# Altium schematic sheet Connectors.SchDoc
size A4; SheetNumber: 1; SheetTotal: 5
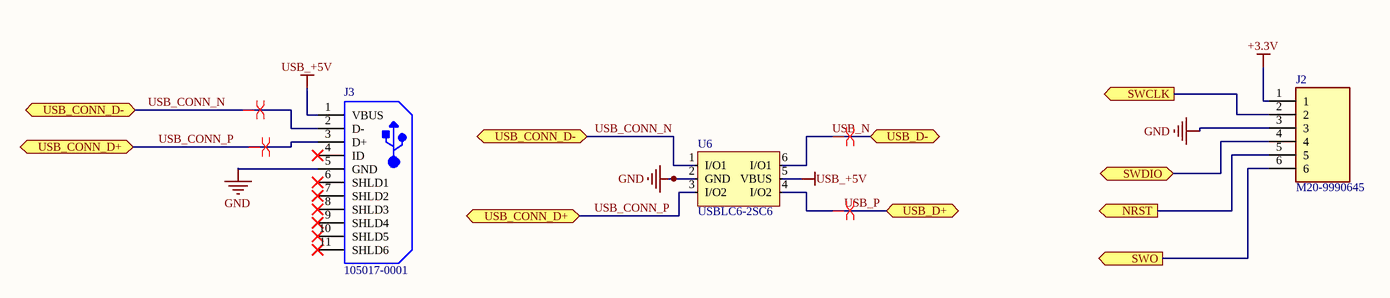
[diagram p0: Connectors.SchDoc]

## Parts
J2  M20-9990645  [M20-9990645-Footprint-1]
J3  105017-0001  [USB-MICRO-B_V]
U6  USBLC6-2SC6  [STM-SOT23-6L_V]

## Ports
NRST (out, see MCU[2A], MCU[2B]), SWCLK (out, see MCU[2C]), SWDIO (bidir, see MCU[2C]), SWO (out, see MCU[3B]), USB_CONN_D+ (bidir, see Connectors[1B]), USB_CONN_D+ (bidir, see Connectors[2C]), USB_CONN_D- (bidir, see Connectors[1B]), USB_CONN_D- (bidir, see Connectors[2B]), USB_D+ (bidir, see MCU[2C]), USB_D- (bidir, see MCU[2C])

## Nets
+3.3V: J2.1
GND: J2.3 J3.5(GND) U6.2(GND)
USB_+5V: J3.1(VBUS) U6.5(VBUS)
NRST: J2.5 ; port NRST
SWCLK: J2.2 ; port SWCLK
SWDIO: J2.4 ; port SWDIO
SWO: J2.6 ; port SWO
USB_CONN_N: J3.2(D-) U6.1(I/O1) ; port USB_CONN_D-
USB_CONN_P: J3.3(D+) U6.3(I/O2) ; port USB_CONN_D+
USB_N: U6.6(I/O1) ; port USB_D-
USB_P: U6.4(I/O2) ; port USB_D+

Not connected (* = marked no-connect by the designer): J3 4(ID)* 6(SHLD1)* 7(SHLD2)* 8(SHLD3)* 9(SHLD4)* 10(SHLD5)* 11(SHLD6)*

## Layout directives
differential pair: USB_CONN_N, USB_CONN_P, USB_N, USB_P

## Library data of the parts
J2 = CMP-002-00072-1: Board Connector, 6 Contact(s), 1 Row(s), Male, Straight, 0.1 inch Pitch, Solder Terminal, Locking, Black Insulator; Min Operating Temperature: -40°C; Max Operating Temperature: 105°C; Mounting Technology: Board; RoHS Compliant: Yes; Connector Type: BOARD CONNECTOR
J3 = CMP-2000-05827-1: Micro-USB B Receptacle, Right Angle, Bottom Mount, Surface Mount, with Solder Tabs, -30 to 85 degC, 5-Pin USB, RoHS, Tape and Reel; Manufacturer: Molex; Featured Product: Micro-USBConnectorsUSBConnectors; Other Names: WM1399DKR; Package Version: Rev. F, 12/2012; Number of Contacts: 5; Connector Type: USB-microB; Catalog Drawings: 1050170001; 3D Model: 105017-0001.stp; Mating Products: WM17145-ND-CABLEMICROUSBBTOSTDA1.0MWM17147-ND-CABLEMICROUSBBTOSTDA2.0MWM17146-ND-CABLEMICROUSBBTOSTDA1.5M; PCN Assembly/Origin: ResinSupplier21/Oct/2015; Voltage - Max: 30V; Online Catalog: Molex-MicroUSB; Manufacturer URL: http://www.molex.com/; Package Description: 5-Leads USB, Micro B, Body 7.5 x 5 mm, Pitch 0.65 mm; Datasheet URL: http://www.molex.com/elqNow/elqRedir.htm?ref=http://www.molex.com/webdocs/datasheets/pdf/en-us/1050170001_IO_CONNECTORS.pdf; Ingress Protection: -; Datasheet Version: 03/2016; Mounting Type: BoardCutout,SurfaceMount,RightAngle; Circuits: 5; Standard Package: 1; Package Reference: MICRO-B; Package URL: http://www.molex.com/pdm_docs/sd/1050170001_sd.pdf; Category: Connectors,Interconnects; Series: -; RoHS Information: 1050170001CertofCompliance; Features: Shielded,SolderRetention; Family: USB,DVI,HDMIConnectors; Specifications: -; Gender: Receptacle; Packaging: Digi-Reel®; Mounting Technology: SurfaceMount
U6 = CMP-00024-00006-1: Trans Voltage Suppressor Diode, 5V V(RWM), Unidirectional, 1 Element, Silicon; RoHS Compliant: Yes; Pins: 6; Min Operating Temperature: -40°C; Max Operating Temperature: 125°C